# EAGLE design dual_supply (EAGLE 7.1.0)
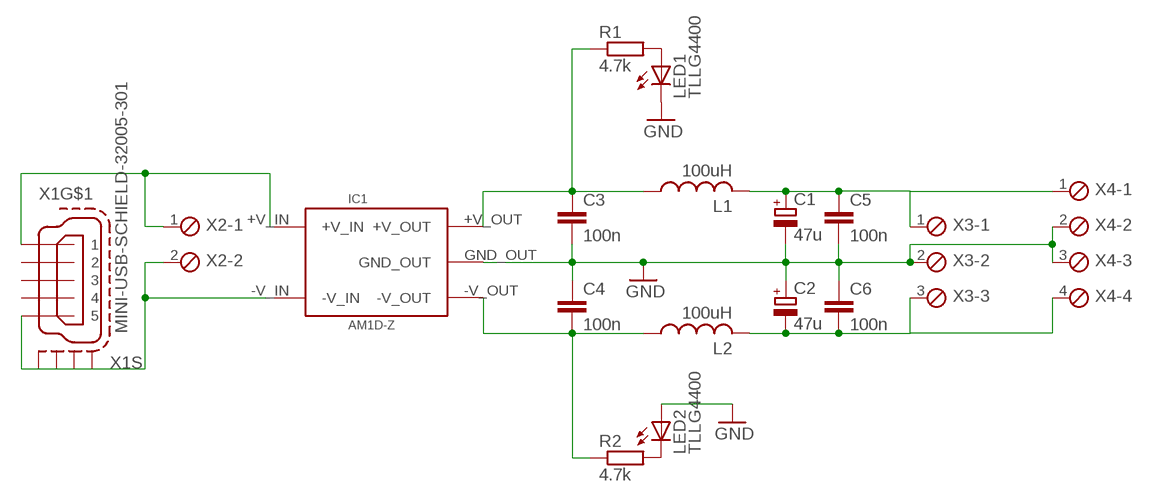
[diagram p0: schematic, sheet 1]

## Parts
C1  47u  CPOL-EUE3.5-8  [E3,5-8]
C2  47u  CPOL-EUE3.5-8  [E3,5-8]
C3  100n  C-EUC0805  [C0805]
C4  100n  C-EUC0805  [C0805]
C5  100n  C-EUC0805  [C0805]
C6  100n  C-EUC0805  [C0805]
IC1  AM1D-Z  [AM1D-Z]
L1  100uH  L-USIR-2  [IR-2]
L2  100uH  L-USIR-2  [IR-2]
LED1  TLLG4400  [LED3MM]
LED2  TLLG4400  [LED3MM]
R1  4.7k  R-EU_R0805  [R0805]
R2  4.7k  R-EU_R0805  [R0805]
X1  MINI-USB-SCHIELD-32005-301  [32005-301]
X2  MPT2  [2POL254]
X3  MPT3  [3POL254]
X4  MPT4  [4POL254]

## Nets
+5V: C1.+ C5.1 L1.2 X3.1 X4.1
-5V: C2.- C6.2 L2.2 X3.3 X4.4
GND: C1.- C2.+ C3.2 C4.1 C5.2 C6.1 IC1.GND_OUT LED1.K(C) LED2.A X3.2 X4.2 X4.3
N$1: IC1.-V_IN X1.5 X1.M1(S:S1) X1.M2(S:S2) X1.M3(S:S3) X1.M4(S:S4) X2.2
N$2: IC1.+V_IN X1.1 X2.1
N$3: C3.1 IC1.+V_OUT L1.1 R1.1
N$4: LED1.A R1.2
N$5: C4.2 IC1.-V_OUT L2.1 R2.1
N$8: LED2.K(C) R2.2
Unconnected: X1.2 X1.3 X1.4

## Library data of the parts
C1 C2 = rcl:CPOL-EU: POLARIZED CAPACITOR, European symbol
C3-C6 = rcl:C-EU: CAPACITOR, European symbol
IC1 = balmer:AM1D-Z: Voltage Converter Dual output
L1 L2 = rcl:L-US: INDUCTOR, American symbol
LED1 LED2 = led:TLLG4400: Low Current (2mA) LED 3 mm Tinted Diffused Package color GREEN Source: Data sheet <http://www.farnell.com/datasheets/391098.pdf>; MF: VISHAY SEMICONDUCTOR; OC_FARNELL: 1612435
R1 R2 = rcl:R-EU_: RESISTOR, European symbol
X1 = con-cypressindustries:MINI-USB-SCHIELD-: MINI USB-B Conector Source: www.cypressindustries.com; OC_FARNELL: unknown; OC_NEWARK: unknown
X2 = con-phoenix-254:MPT2: PHOENIX CONNECTOR; OC_FARNELL: unknown; OC_NEWARK: unknown
X3 = con-phoenix-254:MPT3: PHOENIX CONNECTOR; OC_FARNELL: unknown; OC_NEWARK: unknown
X4 = con-phoenix-254:MPT4: PHOENIX CONNECTOR; OC_FARNELL: unknown; OC_NEWARK: unknown

## Board
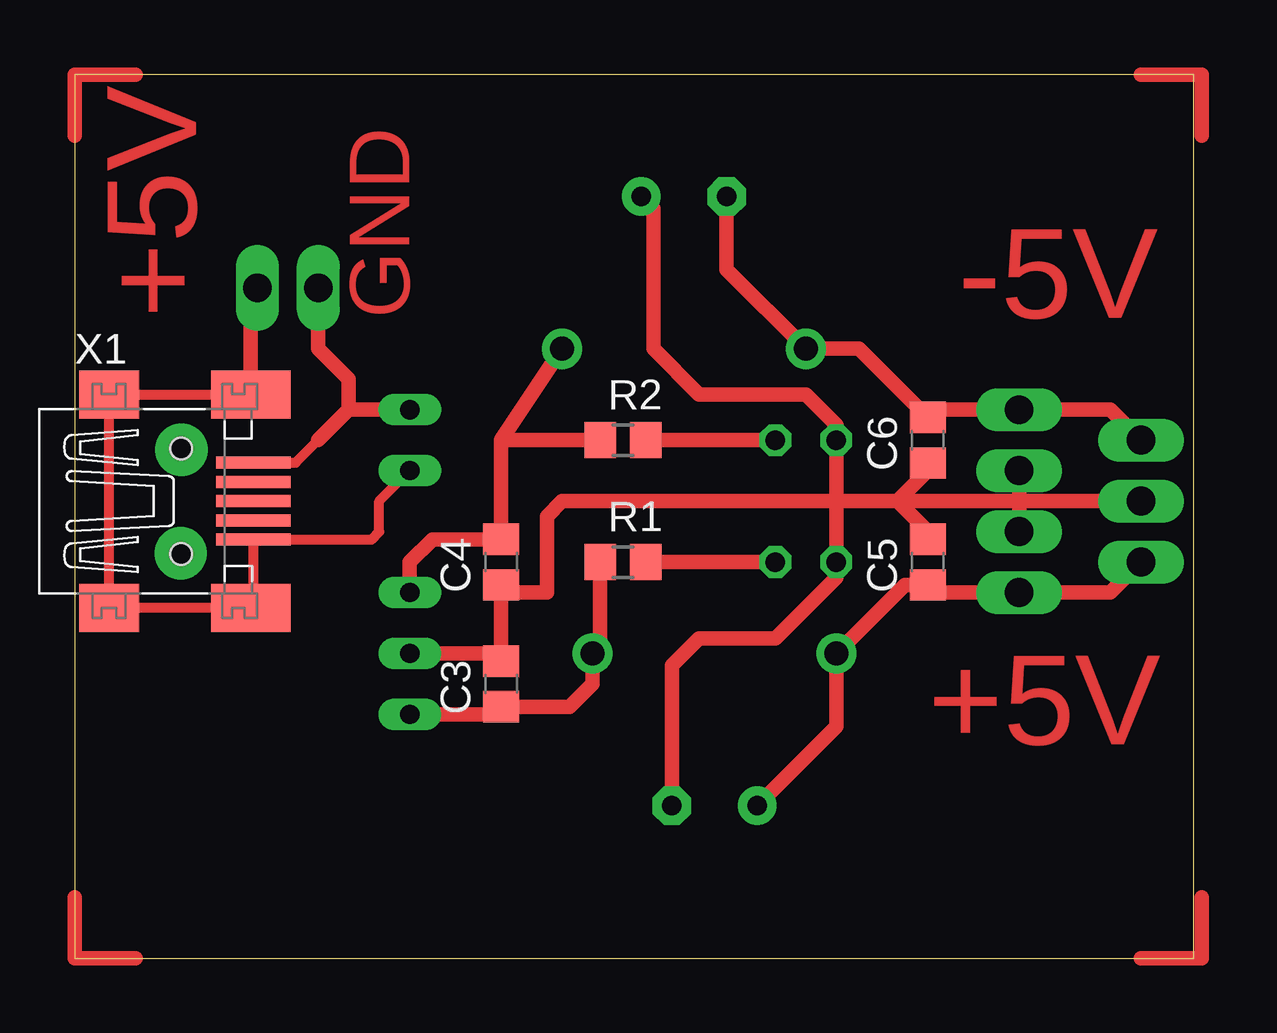
[diagram p1: board, top side]
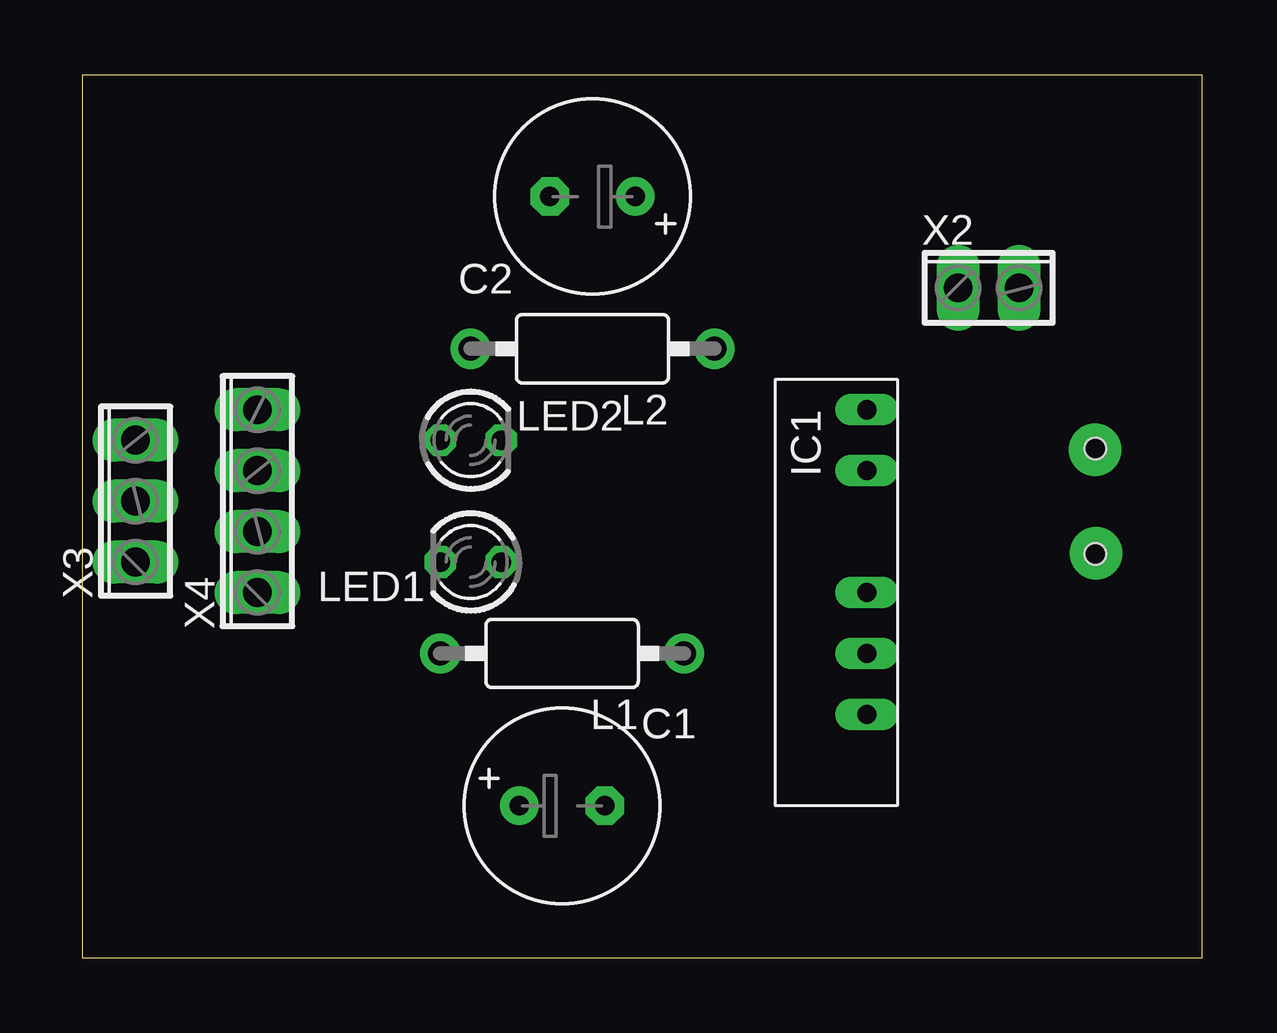
[diagram p2: board, bottom side, seen from below]

Size 46.66 x 36.82 mm. Coordinates in mm from the lower left corner, seen from the top.
Outline: 0,0 46.66,0 46.66,36.82 0,36.82 0,0
Copper layers (1*16): Top 0.035mm / dielectric 1.5mm / Bottom 0.035mm
Design rules "default": minimum track width 10mil, minimum drill 24mil, track to track 8mil, track to pad 8mil, pad to pad 8mil, via to via 8mil, smd to smd 8mil, copper to edge 40mil, drill to drill 8mil, minimum pad ring 10mil, minimum via ring 8mil, stop-mask expansion 4mil, vias tented up to drill 0mil, thermal gap 10mil

### Footprints (pad centres in the part's own frame; a part is rotated, then mirrored left to right if it is on the bottom)
E3,5-8 = drill 0.813 pad 1.6: + -1.778,0 | drill 0.813 pad 1.6 octagon: - 1.778,0
C0805 = smd 1.3 x 1.5: 1 -0.95,0; 2 0.95,0
AM1D-Z = drill 0.8 long: +V_IN 0,-7.62; +V_OUT 0,5.08; -V_IN 0,-5.08; -V_OUT 0,0; GND_OUT 0,2.54
IR-2 = drill 1 pad 1.676: 1 -5.08,0; 2 5.08,0
LED3MM = drill 0.813 octagon: A -1.27,0; K 1.27,0
R0805 = smd 1.3 x 1.5: 1 -0.95,0; 2 0.95,0
32005-301 = smd 3.1 x 0.5: 1 3,1.6; 2 3,0.8; 3 3,0; 4 3,-0.8; 5 3,-1.6 | smd 2.5 x 2: M1 -3,-4.45; M2 -3,4.45 | smd 3.3 x 2: M3 2.9,4.45; M4 2.9,-4.45 | hole 0.9: 0,2.2; 0,-2.2
2POL254 = drill 1.2 long: 1 -1.27,0; 2 1.27,0
3POL254 = drill 1.2 long: 1 -2.54,0; 2 0,0; 3 2.54,0
4POL254 = drill 1.2 long: 1 -3.81,0; 2 -1.27,0; 3 1.27,0; 4 3.81,0

### Placement (x,y rotation side)
C1  26.67,6.35 0 bottom
C2  25.4,31.75 180 bottom
C3  17.78,11.43 90 top
C4  17.78,16.51 90 top
C5  35.56,16.51 90 top
C6  35.56,21.59 90 top
IC1  13.97,15.24 180 bottom
L1  26.67,12.7 180 bottom
L2  25.4,25.4 180 bottom
LED1  30.48,16.51 180 bottom
LED2  30.48,21.59 0 bottom
R1  22.86,16.51 0 top
R2  22.86,21.59 0 top
X1  4.45,19.05 0 top
X2  8.89,27.94 0 bottom
X3  44.45,19.05 90 bottom
X4  39.37,19.05 90 bottom

### Tracks (layer width: path | path; a pad name or v marks a point on that pad's centre or on a via)
+5V
  Top 0.61: C1.+ 31.75,9.65 L1.2 34.61,15.56 C5.1 35.88,15.24 X4.1 43.18,15.24 X3.1
-5V
  Top 0.61: C2.- 27.18,28.7 L2.2 32.7,25.4 C6.2 35.88,22.86 X4.4 43.18,22.86 X3.3
GND
  Top 0.406: C4.1 17.78,15.24
  Top 0.61: C5.2 35.56,17.78 34.29,19.05 | 34.29,19.05 31.75,19.05 | 31.75,19.05 20.32,19.05 19.68,18.41 19.68,15.24 17.78,15.24 C4.1 C3.2 17.46,12.7 IC1.GND_OUT | 31.75,19.05 LED1.K 31.75,15.88 29.21,13.34 26.04,13.34 25.4,12.7 24.89,12.19 C1.- | 31.75,19.05 LED2.A 31.75,22.23 30.48,23.5 26.04,23.5 24.13,25.4 24.13,31.24 C2.+ | C6.1 35.56,20.32 34.29,19.05 | X4.3 39.37,19.05 | 39.37,19.05 34.29,19.05 | X4.2 39.37,19.05 | X3.2 39.37,19.05
N$1
  Top 0.406: X1.M3 X1.M2 1.45,15.24 | X1.M1 1.45,15.24 | 1.45,15.24 2.08,14.6 X1.M4 7.45,14.7 X1.5 12.37,17.45 12.7,17.78 12.7,19.05 IC1.-V_IN
  Top 0.61: X1.M3 7.34,27.66 X2.2
N$2
  Top 0.406: X1.1 9.22,20.65 10.16,21.59
  Top 0.61: 10.16,21.59 11.43,22.86 | 11.43,22.86 IC1.+V_IN | X2.1 10.16,25.4 11.43,24.13 11.43,22.86
N$3
  Top 0.61: R1.1 21.91,13.02 L1.1 21.59,11.43 20.64,10.48 C3.1 17.46,10.16 IC1.+V_OUT
N$4
  Top 0.61: R1.2 LED1.A
N$5
  Top 0.61: 17.78,21.59 C4.2 14.92,17.46 13.97,16.51 IC1.-V_OUT | 17.78,21.59 L2.1 | R2.1 17.78,21.59
N$6  (via drill 0.6 pad 2.18)
  other vias: 4.45,21.19
N$7  (via drill 0.6 pad 2.18)
  other vias: 4.42,16.87
N$8
  Top 0.61: LED2.K R2.2
N$9
  Top 0.61: 0,2.54 0,0 2.54,0
N$10
  Top 0.61: 0,34.29 0,36.83 2.54,36.83
N$11
  Top 0.61: 44.45,36.83 46.99,36.83 46.99,34.29
N$12
  Top 0.61: 46.99,2.54 46.99,0 44.45,0

### Text on the board
Top: +5V | GND | -5V | +5V